# Altium schematic sheet RS-485.SchDoc
size A4
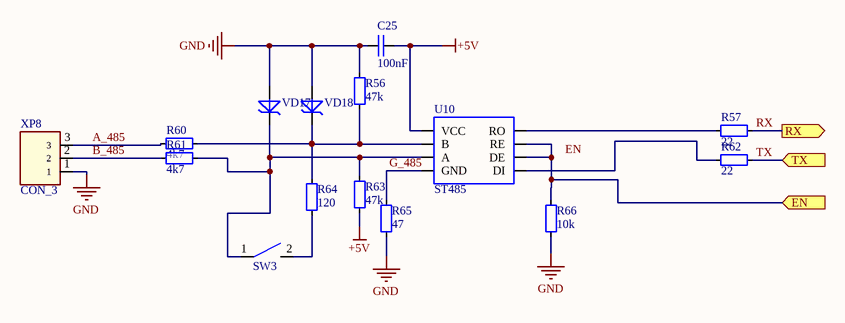
[diagram p0: RS-485.SchDoc]

## Parts
C25  100nF  [SMD_0805]
R56  47k  [SMD_0805]
R57  22  [SMD_0805]
R60  4k7  [SMD_0805]
R61  4k7  [SMD_0805]
R62  22  [SMD_0805]
R63  47k  [SMD_0805]
R64  120  [SMD_0805]
R65  47  [SMD_0805]
R66  10k  [SMD_0805]
SW3  SW_DIP/2.54  [DIP-SW/2.54/1]  (value not drawn)
U10  ST485  [SO8-150mil]
VD17  (no value)  [DO214-AC]
VD18  (no value)  [DO214-AC]
XP8  CON_3  [MW-3M-2.0]

## Ports
EN (in), RX (out), TX (in)

## Nets
+5V: C25.2 R63.1 U10.8(VCC)
GND: C25.1 R56.2 R65.1 R66.1 VD17.2 VD18.2 XP8.1
A_485: R60.2 XP8.3
B_485: R61.2 XP8.2
EN: R66.2 U10.2(RE) U10.3(DE) ; port EN
G_485: R65.2 U10.5(GND)
RX: R57.1 ; port RX
TX: R62.1 ; port TX
NetR56_1: R56.1 R60.1 R64.2 U10.7(B) VD18.1
NetR57_2: R57.2 U10.1(RO)
NetR61_1: R61.1 R63.2 SW3.1 U10.6(A) VD17.1
NetR62_2: R62.2 U10.4(DI)
NetR64_1: R64.1 SW3.2

Not connected (* = marked no-connect by the designer): SW3 3 4

## Notes on the sheet
- Labels drawn without touching a wire or pin: EN

## Library data of the parts
C25 = C_NONE_POLAR: None polar capacitor; Value: 100nF; Case: 0805
R56 R57 R60-R66 = RES: Resistor; Case: 0805
  R56 R63: Value: 47k
  R57 R62: Value: 22
  R60 R61: Value: 4k7
  R64: Value: 120
  R65: Value: 47
  R66: Value: 10k
SW3 = SW: Switch
U10 = ST485: RS485 interface
VD17 VD18 = DIOSE_TVS: TVS Diode